# Altium schematic sheet Sheet4.SchDoc: Наименование
size 420 x 297 mm; ApprovedBy: Vasil; CheckedBy: Vasil; Author: Vasil; CompanyName: Vasil; DrawnBy: n.a.; Engineer: Vasil; SheetNumber: 4; SheetTotal: 5; PageSetup: Record=PageOptions|CenterHorizontal=True|CenterVertical=True|PrintScale=0.94|XCorrection=1.00|YCorrection=1.00|PrintKind=1|BorderSize=5000000|LeftOffset=0|BottomOffset=0|Orientation=1|PaperLength=1000|PaperWidth=1000|Scale=100|PaperSource=7|PrintQuality=-4|MediaType=1|DitherType=10|PaperKind=A4|PrintScaleMode=1; DecimalNumber: 000.00006.001.VG; HeadOfSector: n.a.; MainDevice: HW; Name: CNC_interfaces_board; DocumentName: Sheet1.SCHDOC
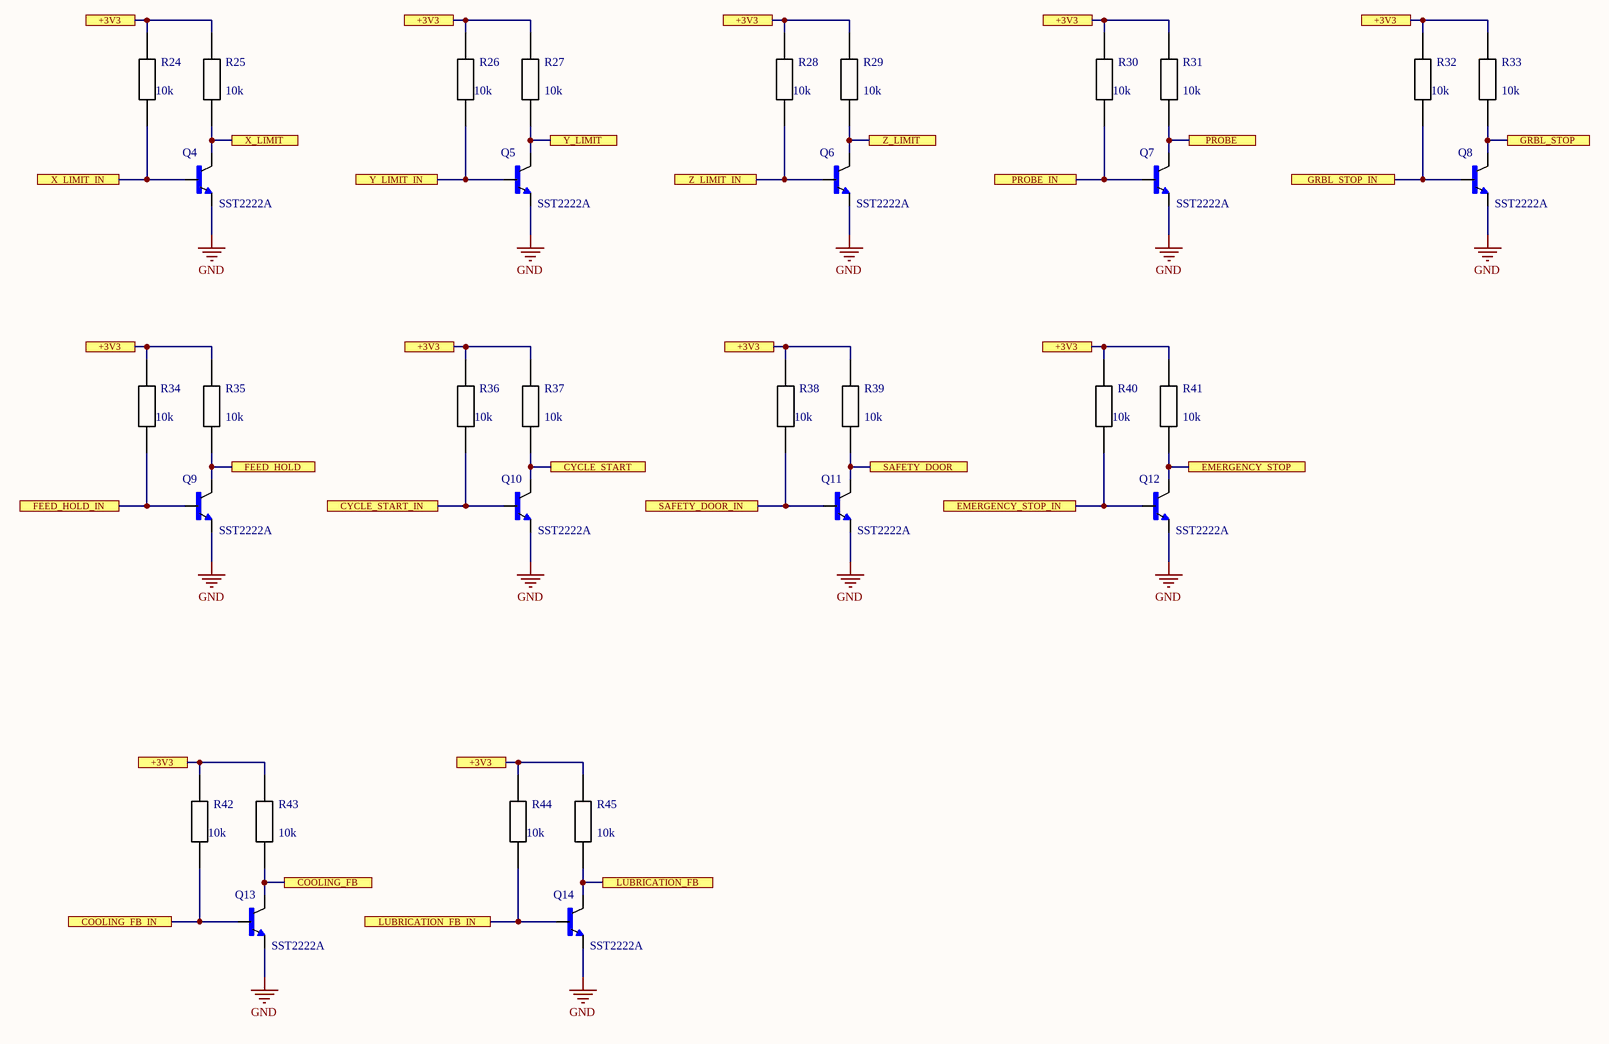
[diagram p0: Sheet4.SchDoc]

## Parts
Q4  SST2222A  [SOT-23-3]
Q5  SST2222A  [SOT-23-3]
Q6  SST2222A  [SOT-23-3]
Q7  SST2222A  [SOT-23-3]
Q8  SST2222A  [SOT-23-3]
Q9  SST2222A  [SOT-23-3]
Q10  SST2222A  [SOT-23-3]
Q11  SST2222A  [SOT-23-3]
Q12  SST2222A  [SOT-23-3]
Q13  SST2222A  [SOT-23-3]
Q14  SST2222A  [SOT-23-3]
R24  10k  [SMD 0805]
R25  10k  [SMD 0805]
R26  10k  [SMD 0805]
R27  10k  [SMD 0805]
R28  10k  [SMD 0805]
R29  10k  [SMD 0805]
R30  10k  [SMD 0805]
R31  10k  [SMD 0805]
R32  10k  [SMD 0805]
R33  10k  [SMD 0805]
R34  10k  [SMD 0805]
R35  10k  [SMD 0805]
R36  10k  [SMD 0805]
R37  10k  [SMD 0805]
R38  10k  [SMD 0805]
R39  10k  [SMD 0805]
R40  10k  [SMD 0805]
R41  10k  [SMD 0805]
R42  10k  [SMD 0805]
R43  10k  [SMD 0805]
R44  10k  [SMD 0805]
R45  10k  [SMD 0805]

## Ports
+3V3, COOLING_FB, COOLING_FB_IN, CYCLE_START, CYCLE_START_IN, EMERGENCY_STOP, EMERGENCY_STOP_IN, FEED_HOLD, FEED_HOLD_IN, GRBL_STOP, GRBL_STOP_IN, LUBRICATION_FB, LUBRICATION_FB_IN, PROBE, PROBE_IN, SAFETY_DOOR, SAFETY_DOOR_IN, X_LIMIT, X_LIMIT_IN, Y_LIMIT, Y_LIMIT_IN, Z_LIMIT, Z_LIMIT_IN

## Nets
GND: Q4.1(E) Q5.1(E) Q6.1(E) Q7.1(E) Q8.1(E) Q9.1(E) Q10.1(E) Q11.1(E) Q12.1(E) Q13.1(E) Q14.1(E)
+3V3: R24.1 R25.1 R26.1 R27.1 R28.1 R29.1 R30.1 R31.1 R32.1 R33.1 R34.1 R35.1 R36.1 R37.1 R38.1 R39.1 R40.1 R41.1 R42.1 R43.1 R44.1 R45.1 ; port +3V3
COOLING_FB: Q13.3(C) R43.2 ; port COOLING_FB
COOLING_FB_IN: Q13.2(B) R42.2 ; port COOLING_FB_IN
CYCLE_START: Q10.3(C) R37.2 ; port CYCLE_START
CYCLE_START_IN: Q10.2(B) R36.2 ; port CYCLE_START_IN
EMERGENCY_STOP: Q12.3(C) R41.2 ; port EMERGENCY_STOP
EMERGENCY_STOP_IN: Q12.2(B) R40.2 ; port EMERGENCY_STOP_IN
FEED_HOLD: Q9.3(C) R35.2 ; port FEED_HOLD
FEED_HOLD_IN: Q9.2(B) R34.2 ; port FEED_HOLD_IN
GRBL_STOP: Q8.3(C) R33.2 ; port GRBL_STOP
GRBL_STOP_IN: Q8.2(B) R32.2 ; port GRBL_STOP_IN
LUBRICATION_FB: Q14.3(C) R45.2 ; port LUBRICATION_FB
LUBRICATION_FB_IN: Q14.2(B) R44.2 ; port LUBRICATION_FB_IN
PROBE: Q7.3(C) R31.2 ; port PROBE
PROBE_IN: Q7.2(B) R30.2 ; port PROBE_IN
SAFETY_DOOR: Q11.3(C) R39.2 ; port SAFETY_DOOR
SAFETY_DOOR_IN: Q11.2(B) R38.2 ; port SAFETY_DOOR_IN
X_LIMIT: Q4.3(C) R25.2 ; port X_LIMIT
X_LIMIT_IN: Q4.2(B) R24.2 ; port X_LIMIT_IN
Y_LIMIT: Q5.3(C) R27.2 ; port Y_LIMIT
Y_LIMIT_IN: Q5.2(B) R26.2 ; port Y_LIMIT_IN
Z_LIMIT: Q6.3(C) R29.2 ; port Z_LIMIT
Z_LIMIT_IN: Q6.2(B) R28.2 ; port Z_LIMIT_IN

## Notes on the sheet
- Перв.примен.
- Справ.№
- Подп. и дата
- Инв.№ дубл.
- Взам.инв.№
- Подп.и дата
- Разраб.
- Изм.
- Лист
- № докум.
- Подп.
- Дата
- Лит.
- Масштаб
- Масса
- Т.контр.
- Пров.
- СХЕМА   ЭЛЕКТРИЧЕСКАЯ
- ПРИНЦИПИАЛЬНАЯ
- Листов
- Инв.№ подл.
- Утв.
- Н.контр.
- Нач.сект.
- Формат  A3

## Library data of the parts
Q4-Q14 = SST2222A: Transistor NPN 40V 600mA 300MHz 350mW; Manufacturer: ROHM Semiconductor; Case: SOT-23-3 SST3; HelpURL: https://store.comet.bg/Catalogue/Product/23715/; Model: SST2222A
R24-R45 = Resistor_1: RES; HelpURL: https://store.comet.bg/Catalogue/RES/Resistors/#eyJpcHAiOiIxMDAiLCJtIjoiIn0%3D; Value: 10k